# Altium schematic sheet 01.SchDoc
size A1; SPICEModelCacheUOOCPPED: <root> / <DocumentId>UOOCPPED</DocumentId> / <CacheFrame Number="0"> / <Model Name="cap" Kind="MDL"> / <Text>*Default semiconductor capacitor / .MODEL CAP C()</Text> / </Model> / <Model Name="led0" Kind="MDL"> / <Text>*Typ INFRARED GaAs LED: Vf=1.2V Vr=5V If=40mA trr=3uS / *LED Pinout: 1=A, 2=K / .MODEL LED0 D (IS=93.5P RS=84M N=2.63 BV=5 IBV=10U / + CJO=2.97P VJ=.75 M=.333 TT=4.32U)</Text> / </Model> / <Model Name="spdtrelay" Kind="CKT"> / <Text>*Generic SPDT Relay / *Connections:     COM / *                 | NC / *                 | | NO / *                 | | | T1 / *                 | | | | T2 / *                 | | | | | / .SUBCKT SPDTRELAY 1 2 3 4 5 / + PARAMS: PULLIN=4 DROPOFF=0.1 CONTACT=1m RESISTANCE=500 INDUCTANCE=10m / L1 4 6 {(INDUCTANCE/2)} / L2 5 7 {(INDUCTANCE/2)} / R1 6 7 {RESISTANCE} / BNO 8 0 V={PULLIN}-abs(v(6,7)) / SW1 2 1 8 0 SWNC ON / BNC 9 0 V=abs(v(6,7)) / SW2 3 1 9 0 SWNO OFF / .MODEL SWNC SW(VT={DROPOFF} RON={CONTACT} ) / .MODEL SWNO SW(VT={(PULLIN*0.98)} RON={CONTACT} ) / .ENDS SPDTRELAY</Text> / </Model> / </CacheFrame> / </root>
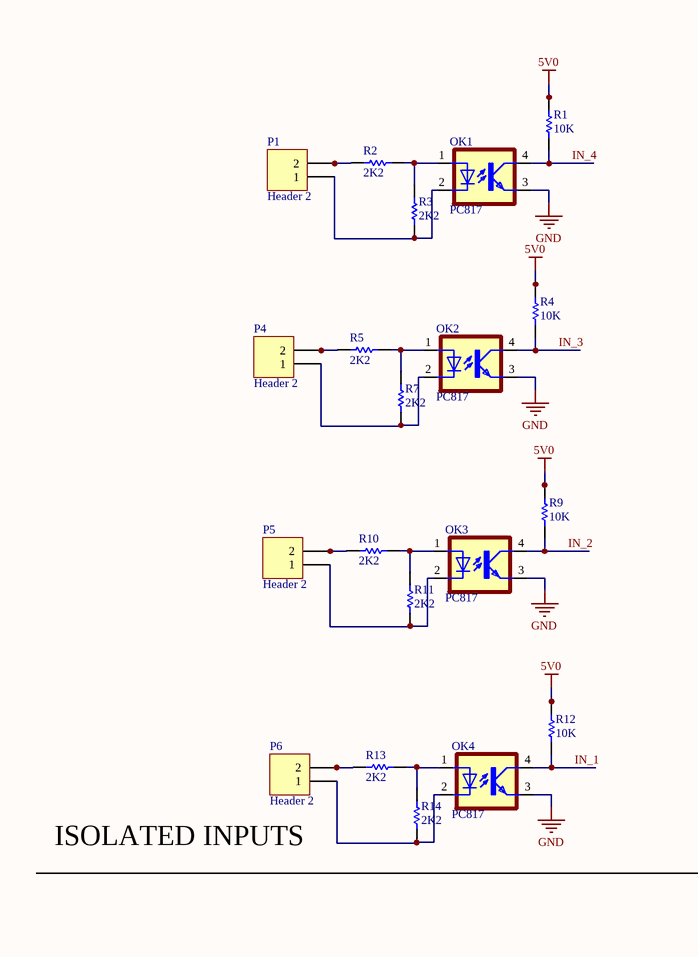
[diagram p0: 01.SchDoc, top left]
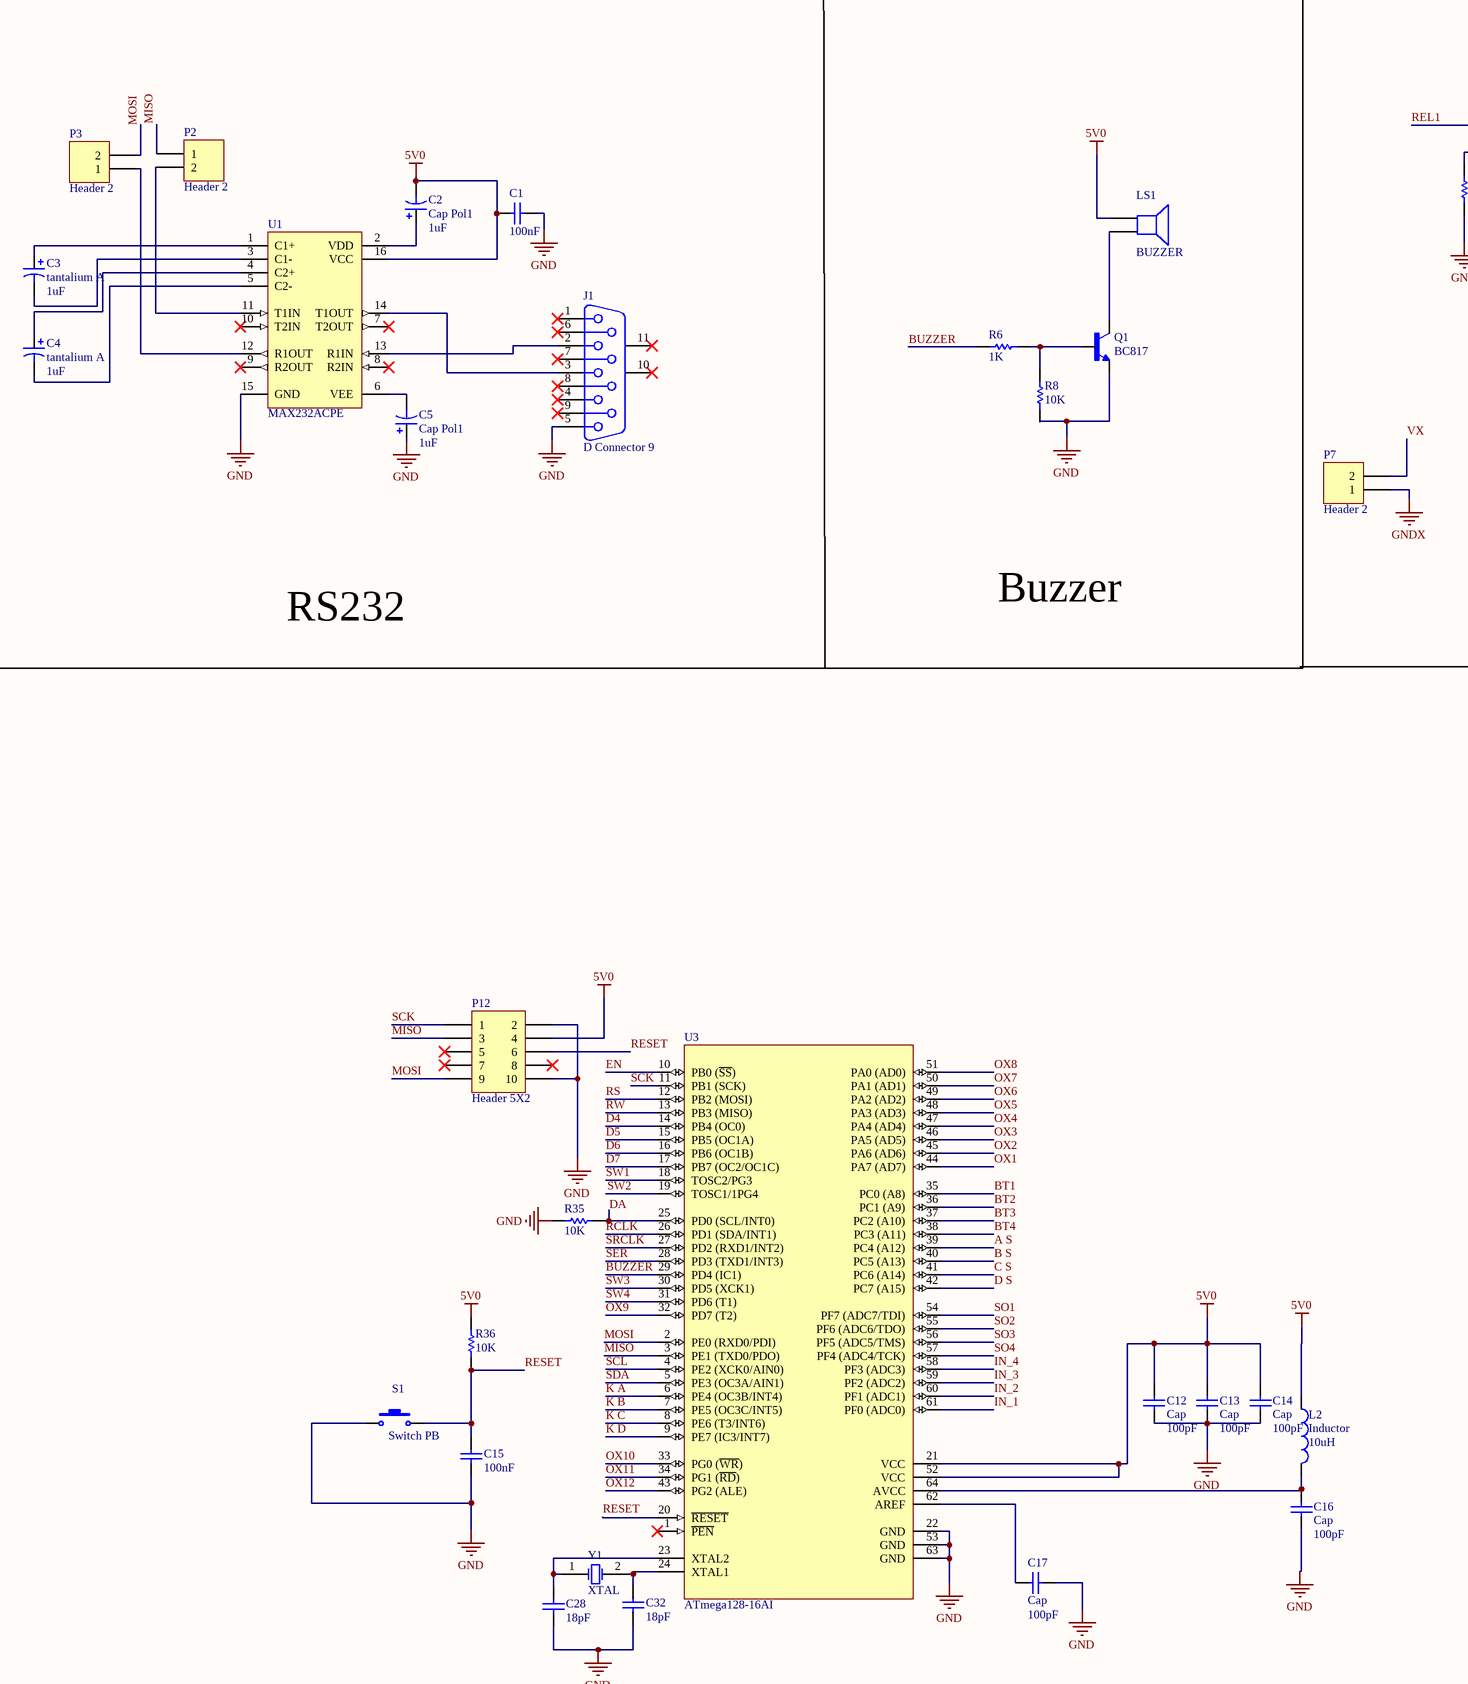
[diagram p1: 01.SchDoc, top middle]
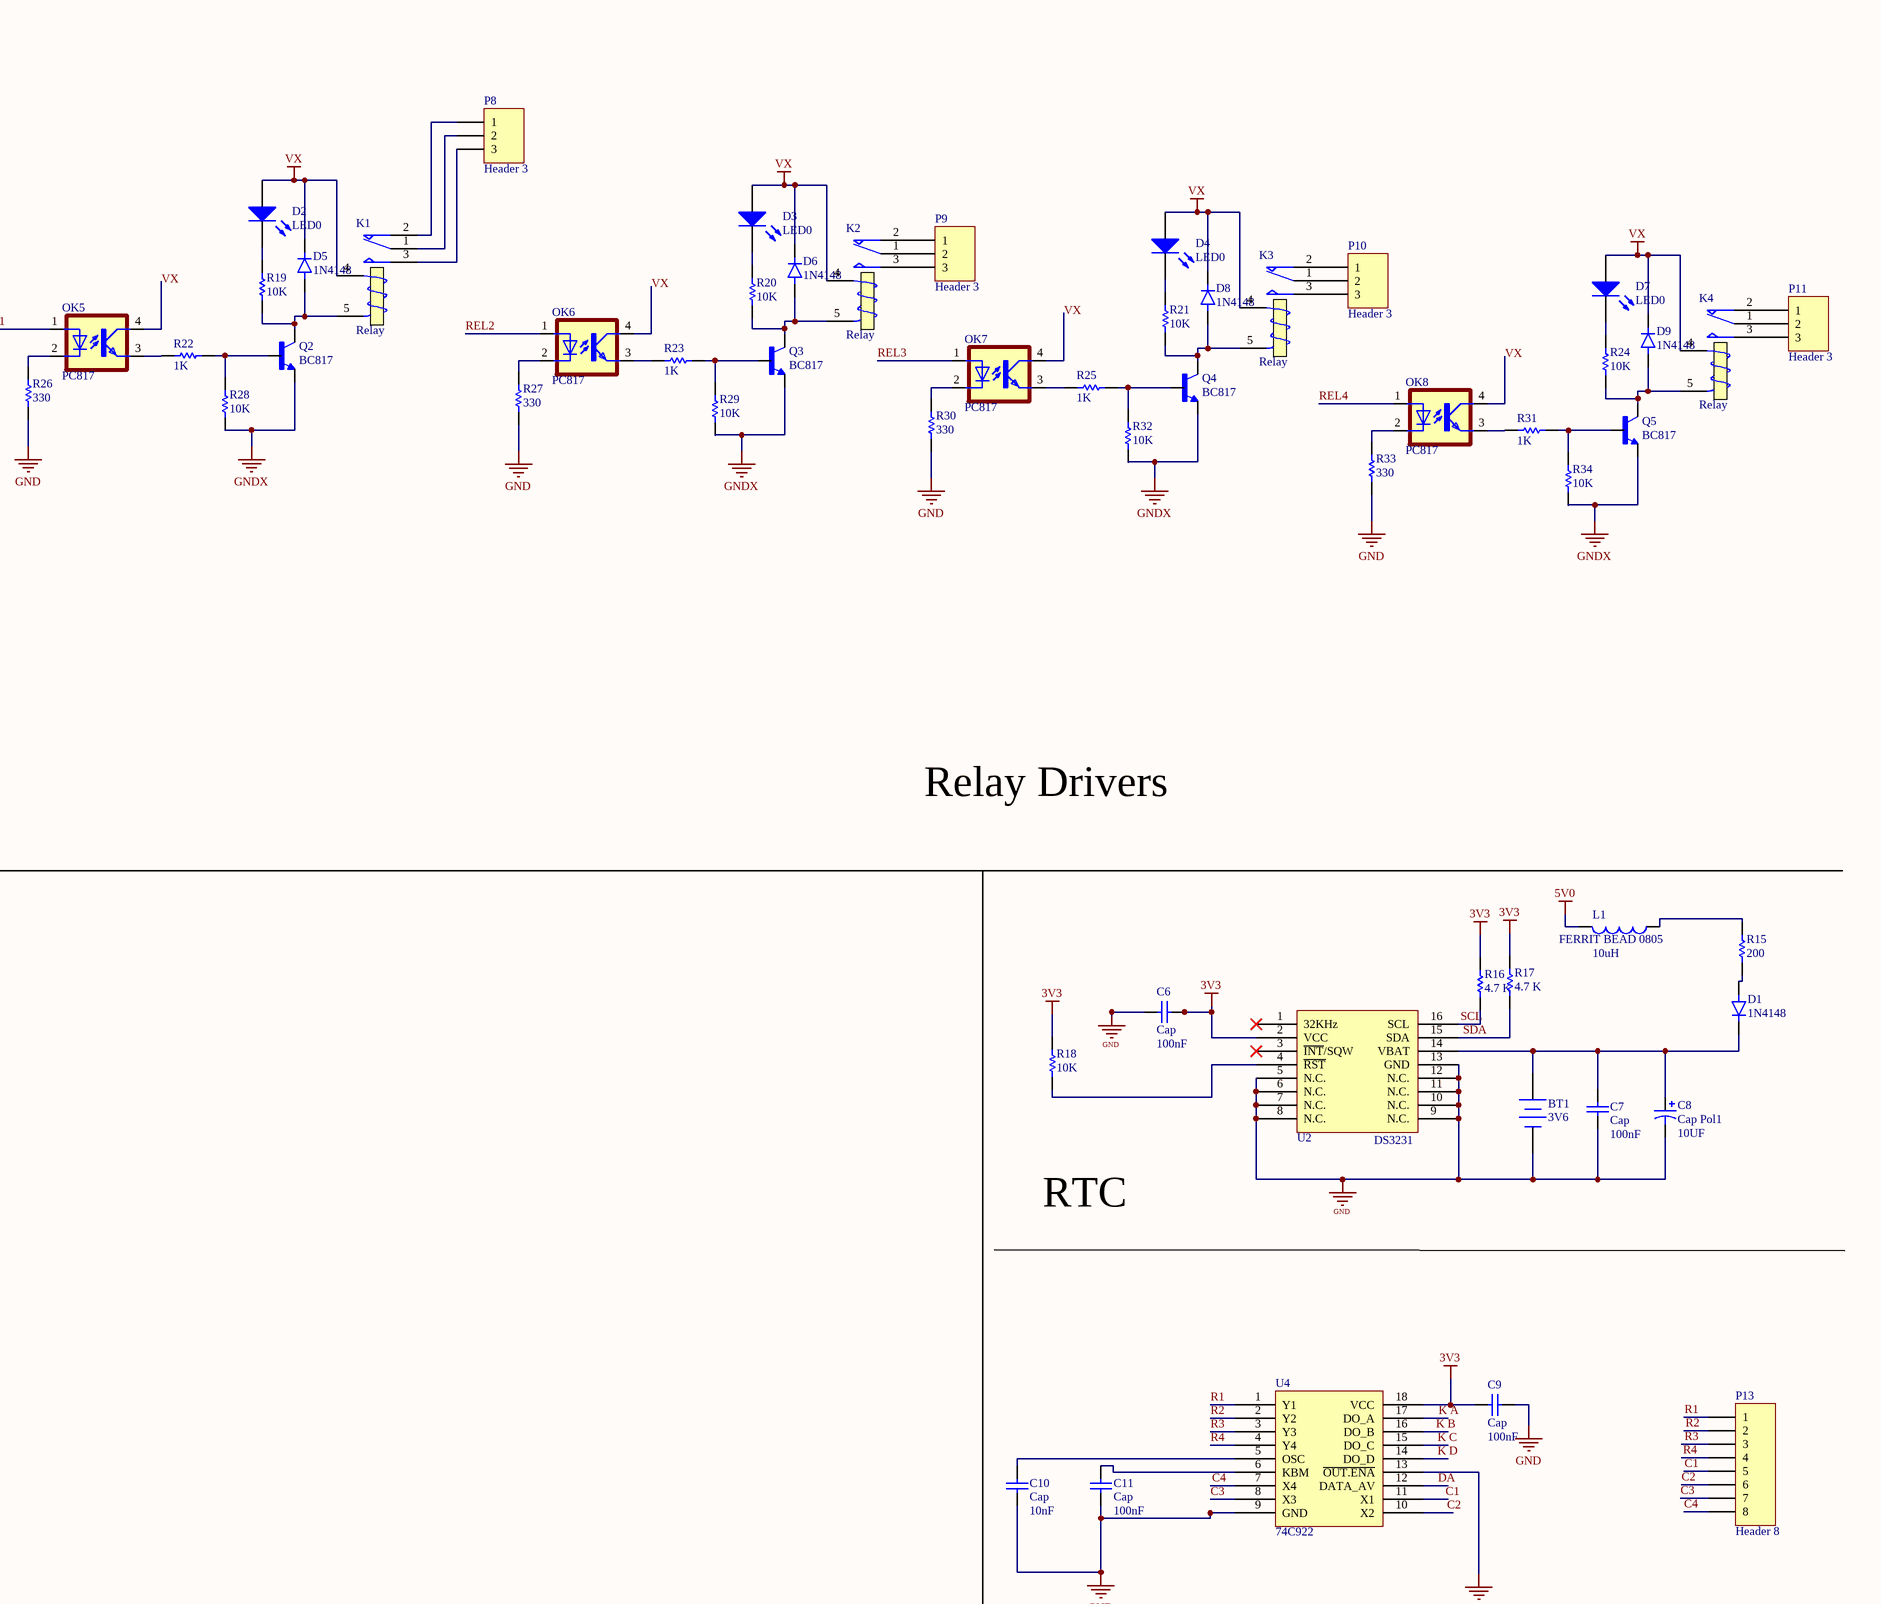
[diagram p2: 01.SchDoc, top right]
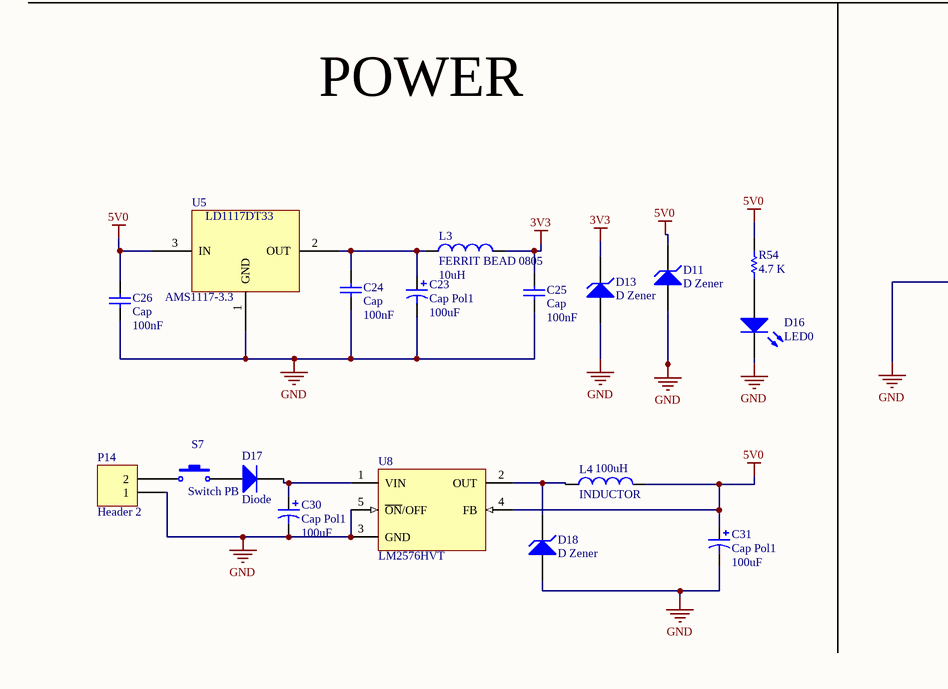
[diagram p3: 01.SchDoc, bottom left]
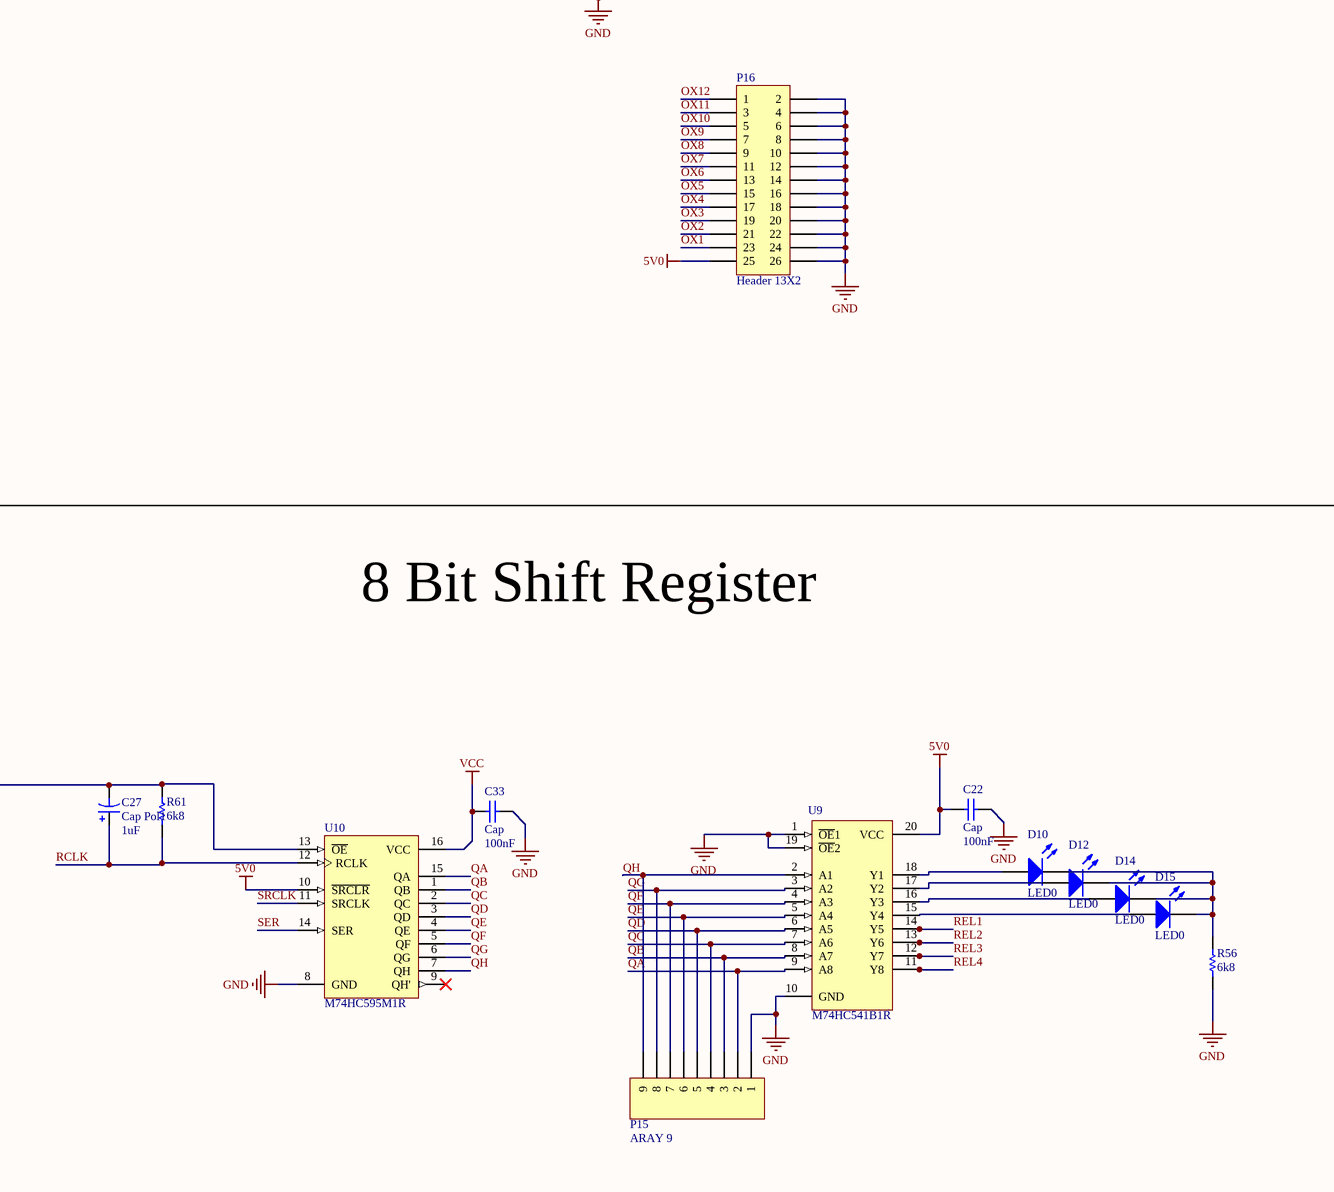
[diagram p4: 01.SchDoc, bottom middle]
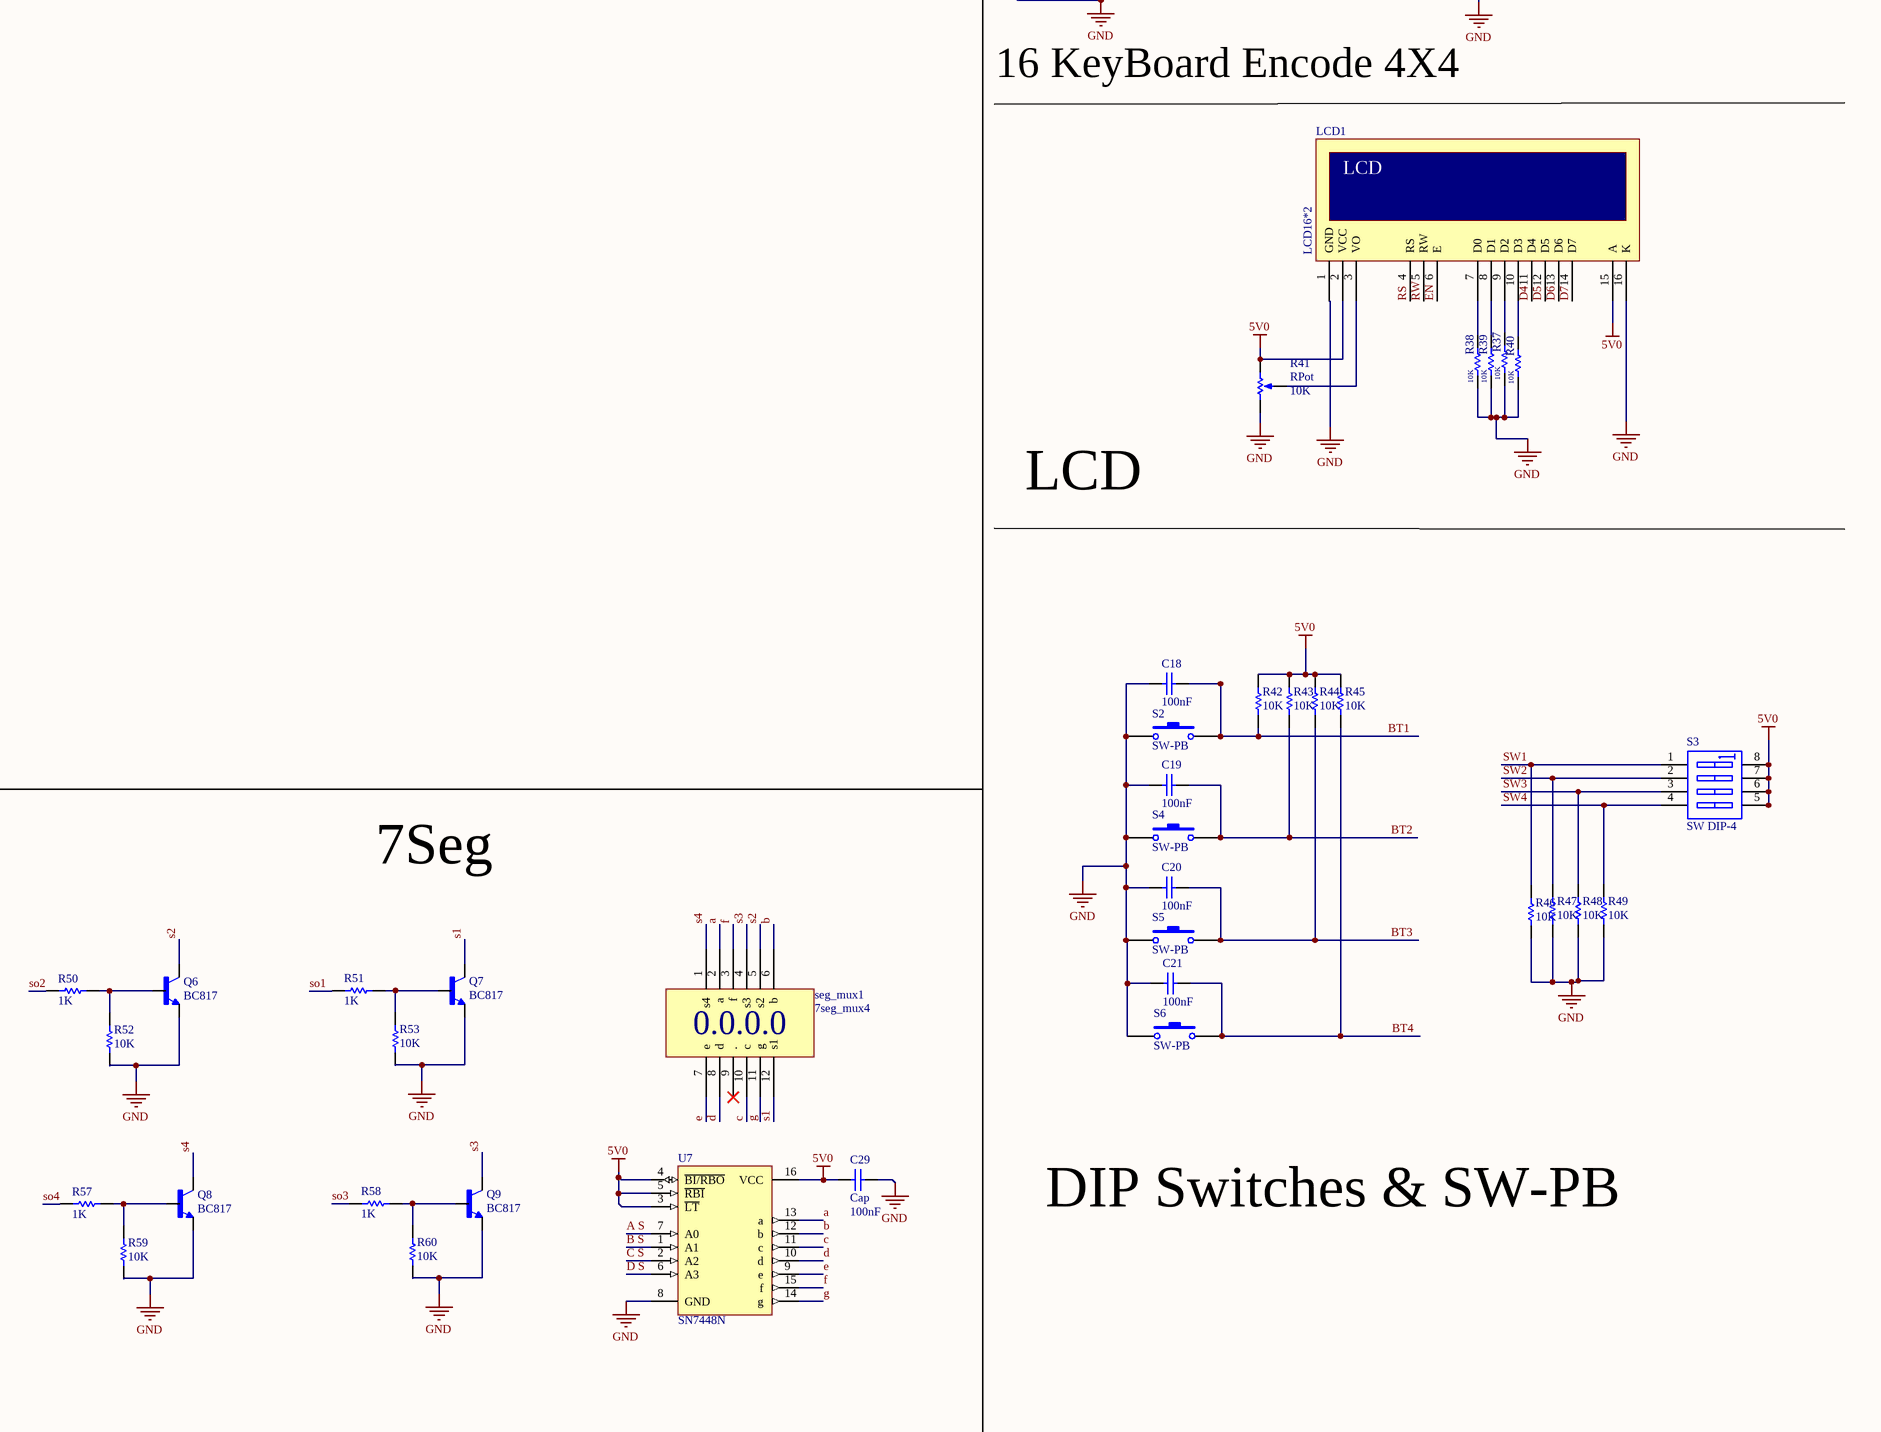
[diagram p5: 01.SchDoc, bottom right]

## Parts
BT1  3V6  [CHARGING_BATT]
C1  100nF  [smd_805]
C2  Cap Pol1  value 1uF  [CAP_SMD_A]
C3  tantalium A  value 1uF  [CAP_SMD_A]
C4  tantalium A  value 1uF  [CAP_SMD_A]
C5  Cap Pol1  value 1uF  [CAP_SMD_A]
C6  Cap  value 100nF  [smd_805]
C7  Cap  value 100nF  [smd_805]
C8  Cap Pol1  value 10UF  [C_B]
C9  Cap  value 100nF  [smd_805]
C10  Cap  value 10nF  [smd_805]
C11  Cap  value 100nF  [smd_805]
C12  Cap  value 100pF  [smd_805]
C13  Cap  value 100pF  [smd_805]
C14  Cap  value 100pF  [smd_805]
C15  100nF  [SMD_805]
C16  Cap  value 100pF  [smd_805]
C17  Cap  value 100pF  [SMD_805]
C18  100nF  [smd_805]
C19  100nF  [smd_805]
C20  100nF  [smd_805]
C21  100nF  [smd_805]
C22  Cap  value 100nF  [smd_805]
C23  Cap Pol1  value 100uF  [C_B]
C24  Cap  value 100nF  [SMD_805]
C25  Cap  value 100nF  [smd_805]
C26  Cap  value 100nF  [smd_805]
C27  Cap Pol1  value 1uF  [CAP_SMD_A]
C28  18pF  [SMD_805]
C29  Cap  value 100nF  [smd_805]
C30  Cap Pol1  value 100uF  [C_CYL_SMD2]
C31  Cap Pol1  value 100uF  [C_CYL_smd]
C32  18pF  [SMD_805]
C33  Cap  value 100nF  [smd_805]
D1  1N4148  [tvs]
D2  LED0  [SMD_805]
D3  LED0  [SMD_805]
D4  LED0  [SMD_805]
D5  1N4148  [tvs]
D6  1N4148  [tvs]
D7  LED0  [SMD_805]
D8  1N4148  [tvs]
D9  1N4148  [tvs]
D10  LED0  [SMD_805]
D11  D Zener  [tvs]
D12  LED0  [SMD_805]
D13  D Zener  [tvs]
D14  LED0  [SMD_805]
D15  LED0  [SMD_805]
D16  LED0  [SMD_805]
D17  Diode  [TVS]
D18  D Zener  [DO_214_AB_SMC]
J1  D Connector 9  [COM]
K1  Relay  [RELAY_12v]
K2  Relay  [RELAY_12v]
K3  Relay  [RELAY_12v]
K4  Relay  [RELAY_12v]
L1  FERRIT BEAD 0805  value 10uH  [SMD_805]
L2  Inductor  value 10uH  [smd_805]
L3  FERRIT BEAD 0805  value 10uH  [0402-A]
L4  INDUCTOR  value 100uH  [INDUC_SMD]
LCD1  LCD16*2  [LCD2X16]
LS1  BUZZER  [BUZZER]
OK1  PC817  [PC817_SMD]
OK2  PC817  [PC817_SMD]
OK3  PC817  [PC817_SMD]
OK4  PC817  [PC817_SMD]
OK5  PC817  [PC817_SMD]
OK6  PC817  [PC817_SMD]
OK7  PC817  [PC817_SMD]
OK8  PC817  [PC817_SMD]
P1  Header 2  [pHoenix_2]
P2  Header 2  [pin_2_w]
P3  Header 2  [pin_2_w]
P4  Header 2  [pHoenix_2]
P5  Header 2  [pHoenix_2]
P6  Header 2  [pHoenix_2]
P7  Header 2  [pHoenix_2]
P8  Header 3  [PHOENIX_3]
P9  Header 3  [PHOENIX_3]
P10  Header 3  [PHOENIX_3]
P11  Header 3  [PHOENIX_3]
P12  Header 5X2  [box2x5_3d]
P13  Header 8  [HEADER_1x8]
P14  Header 2  [ADAP_JACK]
P15  ARAY 9  [Aray 9]
P16  Header 13X2  [HEADER_2x13]
Q1  BC817  [SOT23]
Q2  BC817  [SOT23]
Q3  BC817  [SOT23]
Q4  BC817  [SOT23]
Q5  BC817  [SOT23]
Q6  BC817  [SOT23]
Q7  BC817  [SOT23]
Q8  BC817  [SOT23]
Q9  BC817  [SOT23]
R1  10K  [SMD_805]
R2  2K2  [SMD_805]
R3  2K2  [SMD_805]
R4  10K  [SMD_805]
R5  2K2  [SMD_805]
R6  1K  [SMD_805]
R7  2K2  [SMD_805]
R8  10K  [SMD_805]
R9  10K  [SMD_805]
R10  2K2  [SMD_805]
R11  2K2  [SMD_805]
R12  10K  [SMD_805]
R13  2K2  [SMD_805]
R14  2K2  [SMD_805]
R15  200  [SMD_805]
R16  4.7 K  [SMD_805]
R17  4.7 K  [SMD_805]
R18  10K  [SMD_805]
R19  10K  [SMD_805]
R20  10K  [SMD_805]
R21  10K  [SMD_805]
R22  1K  [SMD_805]
R23  1K  [SMD_805]
R24  10K  [SMD_805]
R25  1K  [SMD_805]
R26  330  [SMD_805]
R27  330  [SMD_805]
R28  10K  [SMD_805]
R29  10K  [SMD_805]
R30  330  [SMD_805]
R31  1K  [SMD_805]
R32  10K  [SMD_805]
R33  330  [SMD_805]
R34  10K  [SMD_805]
R35  10K  [SMD_805]
R36  10K  [SMD_805]
R37  10K  [SMD_805]
R38  10K  [SMD_805]
R39  10K  [SMD_805]
R40  10K  [SMD_805]
R41  RPot  value 10K  [POT]
R42  10K  [SMD_805]
R43  10K  [SMD_805]
R44  10K  [SMD_805]
R45  10K  [SMD_805]
R46  10K  [SMD_805]
R47  10K  [SMD_805]
R48  10K  [SMD_805]
R49  10K  [SMD_805]
R50  1K  [SMD_805]
R51  1K  [SMD_805]
R52  10K  [SMD_805]
R53  10K  [SMD_805]
R54  4.7 K  [SMD_805]
R56  6k8  [SMD_805]
R57  1K  [SMD_805]
R58  1K  [SMD_805]
R59  10K  [SMD_805]
R60  10K  [SMD_805]
R61  6k8  [SMD_805]
S1  Switch PB  [SMD_BUTTON]
S2  SW-PB  [SMD_BUTTON]
S3  SW DIP-4  [DIP_8P]
S4  SW-PB  [SMD_BUTTON]
S5  SW-PB  [SMD_BUTTON]
S6  SW-PB  [SMD_BUTTON]
S7  Switch PB  [KEY1]
seg_mux1  7seg_mux4  [S7_MUX]
U1  MAX232ACPE  [SOP16]
U2  DS3231  [SO16]
U3  ATmega128-16AI  [ATM128]
U4  74C922  [DIP_18P]
U5  AMS1117-3.3  [SOT223]
U7  SN7448N  [DIP_16P]
U8  LM2576HVT  [LM2576_SMD]
U9  M74HC541B1R  [SOP20]
U10  M74HC595M1R  [SO16_L]
Y1  XTAL  [xtal_smd]

## Nets
3V3: C6.2 C9.2 C25.1 D13.2(K) L3.2 R16.2 R17.2 R18.2 U2.2(VCC) U4.18(VCC)
5V0: C1.1 C2.2 C12.1 C13.1 C14.1 C22.2 C26.1 C29.2 C31.1 D11.2(K) L1.2 L2.1 L4.2 LCD1.2(VCC) LCD1.15(A) LS1.1 P12.4 P16.25 R1.1 R4.1 R9.1 R12.1 R36.2 R41.2(BOT) R42.2 R43.2 R44.2 R45.2 R54.2 S3.5(B4) S3.6(B3) S3.7(B2) S3.8(B1) U1.16(VCC) U3.21(VCC) U3.52(VCC) U5.3(IN) U7.3(~{LT}) U7.4(~{BI/RBO}) U7.5(~{RBI}) U7.16(VCC) U8.4(FB) U9.20(VCC) U10.10(~{SRCLR})
GND: BT1.2(-) C1.2 C5.1 C6.1 C7.2 C8.2 C9.1 C10.2 C11.2 C12.2 C13.2 C14.2 C15.1 C16.2 C17.2 C18.1 C19.1 C20.1 C21.1 C22.1 C23.2 C24.2 C25.2 C26.2 C27.2 C28.1 C29.1 C30.2 C31.2 C32.1 C33.1 D11.1(A) D13.1(A) D16.2(K) D18.1(A) J1.5 LCD1.1(GND) LCD1.16(K) OK1.3(EMIT) OK2.3(EMIT) OK3.3(EMIT) OK4.3(EMIT) P12.2 P12.10 P14.1 P15.1 P16.2 P16.4 P16.6 P16.8 P16.10 P16.12 P16.14 P16.16 P16.18 P16.20 P16.22 P16.24 P16.26 Q1.2(E) Q6.2(E) Q7.2(E) Q8.2(E) Q9.2(E) R8.1 R26.1 R27.1 R30.1 R33.1 R35.1 R37.1 R38.1 R39.1 R40.1 R41.1(TOP) R46.1 R47.1 R48.1 R49.1 R52.1 R53.1 R56.1 R59.1 R60.1 R61.2 S1.1 S2.1 S4.1 S5.1 S6.1 U1.15(GND) U2.5(N.C.) U2.6(N.C.) U2.7(N.C.) U2.8(N.C.) U2.9(N.C.) U2.10(N.C.) U2.11(N.C.) U2.12(N.C.) U2.13(GND) U3.22(GND) U3.53(GND) U3.63(GND) U4.9(GND) U4.13(~{OUT.ENA}) U5.1(GND) U7.8(GND) U8.3(GND) U8.5(~{ON}/OFF) U9.1(~{OE}1) U9.10(GND) U9.19(~{OE}2) U10.8(GND) U10.13(~{OE})
GNDX: P7.1 Q2.2(E) Q3.2(E) Q4.2(E) Q5.2(E) R28.1 R29.1 R32.1 R34.1
VCC: C33.2 U10.16(VCC)
VX: D2.1(A) D3.1(A) D4.1(A) D5.C D6.C D7.1(A) D8.C D9.C K1.4(T1) K2.4(T1) K3.4(T1) K4.4(T1) OK5.4(COL) OK6.4(COL) OK7.4(COL) OK8.4(COL) P7.2
a: seg_mux1.2(a) U7.13(a)
A S: U3.39(PC4_(A12)) U7.7(A0)
b: seg_mux1.6(b) U7.12(b)
B S: U3.40(PC5_(A13)) U7.1(A1)
BT1: C18.2 R42.1 S2.2 U3.35(PC0_(A8))
BT2: C19.2 R43.1 S4.2 U3.36(PC1_(A9))
BT3: C20.2 R44.1 S5.2 U3.37(PC2_(A10))
BT4: C21.2 R45.1 S6.2 U3.38(PC3_(A11))
BUZZER: R6.1 U3.29(PD4_(IC1))
c: seg_mux1.10(c) U7.11(c)
C1: P13.5 U4.11(X1)
C2: P13.6 U4.10(X2)
C3: P13.7 U4.8(X3)
C4: P13.8 U4.7(X4)
C S: U3.41(PC6_(A14)) U7.2(A2)
d: seg_mux1.8(d) U7.10(d)
D4: LCD1.11(D4) U3.14(PB4_(OC0))
D5: LCD1.12(D5) U3.15(PB5_(OC1A))
D6: LCD1.13(D6) U3.16(PB6_(OC1B))
D7: LCD1.14(D7) U3.17(PB7_(OC2/OC1C))
D S: U3.42(PC7_(A15)) U7.6(A3)
DA: R35.2 U3.25(PD0_(SCL/INT0)) U4.12(DATA_AV)
e: seg_mux1.7(e) U7.9(e)
EN: LCD1.6(E) U3.10(PB0_(~{SS}))
f: seg_mux1.3(f) U7.15(f)
g: seg_mux1.11(g) U7.14(g)
IN_1: OK4.4(COL) R12.2 U3.61(PF0_(ADC0))
IN_2: OK3.4(COL) R9.2 U3.60(PF1_(ADC1))
IN_3: OK2.4(COL) R4.2 U3.59(PF2_(ADC2))
IN_4: OK1.4(COL) R1.2 U3.58(PF3_(ADC3))
K A: U3.6(PE4_(OC3B/INT4)) U4.17(DO_A)
K B: U3.7(PE5_(OC3C/INT5)) U4.16(DO_B)
K C: U3.8(PE6_(T3/INT6)) U4.15(DO_C)
K D: U3.9(PE7_(IC3/INT7)) U4.14(DO_D)
MISO: P2.1 P12.3 U3.3(PE1_(TXD0/PDO))
MOSI: P3.2 P12.9 U3.2(PE0_(RXD0/PDI))
OX1: P16.23 U3.44(PA7_(AD7))
OX2: P16.21 U3.45(PA6_(AD6))
OX3: P16.19 U3.46(PA5_(AD5))
OX4: P16.17 U3.47(PA4_(AD4))
OX5: P16.15 U3.48(PA3_(AD3))
OX6: P16.13 U3.49(PA2_(AD2))
OX7: P16.11 U3.50(PA1_(AD1))
OX8: P16.9 U3.51(PA0_(AD0))
OX9: P16.7 U3.32(PD7_(T2))
OX10: P16.5 U3.33(PG0_(~{WR}))
OX11: P16.3 U3.34(PG1_(~{RD}))
OX12: P16.1 U3.43(PG2_(ALE))
QA: P15.2 U9.9(A8) U10.15(QA)
QB: P15.3 U9.8(A7) U10.1(QB)
QC: P15.4 U9.7(A6) U10.2(QC)
QD: P15.5 U9.6(A5) U10.3(QD)
QE: P15.6 U9.5(A4) U10.4(QE)
QF: P15.7 U9.4(A3) U10.5(QF)
QG: P15.8 U9.3(A2) U10.6(QG)
QH: P15.9 U9.2(A1) U10.7(QH)
R1: P13.1 U4.1(Y1)
R2: P13.2 U4.2(Y2)
R3: P13.3 U4.3(Y3)
R4: P13.4 U4.4(Y4)
RCLK: C27.1 R61.1 U3.26(PD1_(SDA/INT1)) U10.12(RCLK)
REL1: OK5.1(A) U9.14(Y5)
REL2: OK6.1(A) U9.13(Y6)
REL3: OK7.1(A) U9.12(Y7)
REL4: OK8.1(A) U9.11(Y8)
RESET: C15.2 P12.6 R36.1 S1.2 U3.20(~{RESET})
RS: LCD1.4(RS) U3.12(PB2_(MOSI))
RW: LCD1.5(RW) U3.13(PB3_(MISO))
s1: Q7.3(C) seg_mux1.12(s1)
s2: Q6.3(C) seg_mux1.5(s2)
s3: Q9.3(C) seg_mux1.4(s3)
s4: Q8.3(C) seg_mux1.1(s4)
SCK: P12.1 U3.11(PB1_(SCK))
SCL: R16.1 U2.16(SCL) U3.4(PE2_(XCK0/AIN0))
SDA: R17.1 U2.15(SDA) U3.5(PE3_(OC3A/AIN1))
SER: U3.28(PD3_(TXD1/INT3)) U10.14(SER)
so1: R51.1 U3.54(PF7_(ADC7/TDI))
so2: R50.1 U3.55(PF6_(ADC6/TDO))
so3: R58.1 U3.56(PF5_(ADC5/TMS))
so4: R57.1 U3.57(PF4_(ADC4/TCK))
SRCLK: U3.27(PD2_(RXD1/INT2)) U10.11(SRCLK)
SW1: R46.2 S3.1(A1) U3.18(TOSC2/PG3)
SW2: R47.2 S3.2(A2) U3.19(TOSC1/1PG4)
SW3: R48.2 S3.3(A3) U3.30(PD5_(XCK1))
SW4: R49.2 S3.4(A4) U3.31(PD6_(T1))
NetBT1_1: BT1.1(+) C7.1 C8.1 D1.C U2.14(VBAT)
NetC2_1: C2.1 U1.2(VDD)
NetC3_1: C3.1 U1.1(C1+)
NetC3_2: C3.2 U1.3(C1-)
NetC4_1: C4.1 U1.4(C2+)
NetC4_2: C4.2 U1.5(C2-)
NetC5_2: C5.2 U1.6(VEE)
NetC10_1: C10.1 U4.5(OSC)
NetC11_1: C11.1 U4.6(KBM)
NetC16_1: C16.1 L2.2 U3.64(AVCC)
NetC17_1: C17.1 U3.62(AREF)
NetC23_1: C23.1 C24.1 L3.1 U5.2(OUT)
NetC28_2: C28.2 U3.23(XTAL2) Y1.1(OSC1)
NetC30_1: C30.1 D17.2(K) U8.1(VIN)
NetC32_2: C32.2 U3.24(XTAL1) Y1.2(OSC2)
NetD1_A: D1.A R15.1
NetD2_2: D2.2(K) R19.2
NetD3_2: D3.2(K) R20.2
NetD4_2: D4.2(K) R21.2
NetD5_A: D5.A K1.5(T2) Q2.3(C) R19.1
NetD6_A: D6.A K2.5(T2) Q3.3(C) R20.1
NetD7_2: D7.2(K) R24.2
NetD8_A: D8.A K3.5(T2) Q4.3(C) R21.1
NetD9_A: D9.A K4.5(T2) Q5.3(C) R24.1
NetD10_1: D10.1(A) U9.18(Y1)
NetD10_2: D10.2(K) D12.2(K) D14.2(K) D15.2(K) R56.2
NetD12_1: D12.1(A) U9.17(Y2)
NetD14_1: D14.1(A) U9.16(Y3)
NetD15_1: D15.1(A) U9.15(Y4)
NetD16_1: D16.1(A) R54.1
NetD18_2: D18.2(K) L4.1 U8.2(OUT)
NetJ1_2: J1.2 U1.13(R1IN)
NetJ1_3: J1.3 U1.14(T1OUT)
NetK1_1: K1.1(COM) P8.2
NetK1_2: K1.2(NC) P8.1
NetK1_3: K1.3(NO) P8.3
NetK2_1: K2.1(COM) P9.2
NetK2_2: K2.2(NC) P9.1
NetK2_3: K2.3(NO) P9.3
NetK3_1: K3.1(COM) P10.2
NetK3_2: K3.2(NC) P10.1
NetK3_3: K3.3(NO) P10.3
NetK4_1: K4.1(COM) P11.2
NetK4_2: K4.2(NC) P11.1
NetK4_3: K4.3(NO) P11.3
NetL1_1: L1.1 R15.2
NetLCD1_3: LCD1.3(VO) R41.3(TAP)
NetLCD1_7: LCD1.7(D0) R38.2
NetLCD1_8: LCD1.8(D1) R39.2
NetLCD1_9: LCD1.9(D2) R37.2
NetLCD1_10: LCD1.10(D3) R40.2
NetLS1_2: LS1.2 Q1.3(C)
NetOK1_1: OK1.1(A) R2.2 R3.2
NetOK1_2: OK1.2(C) P1.1 R3.1
NetOK2_1: OK2.1(A) R5.2 R7.2
NetOK2_2: OK2.2(C) P4.1 R7.1
NetOK3_1: OK3.1(A) R10.2 R11.2
NetOK3_2: OK3.2(C) P5.1 R11.1
NetOK4_1: OK4.1(A) R13.2 R14.2
NetOK4_2: OK4.2(C) P6.1 R14.1
NetOK5_2: OK5.2(C) R26.2
NetOK5_3: OK5.3(EMIT) R22.1
NetOK6_2: OK6.2(C) R27.2
NetOK6_3: OK6.3(EMIT) R23.1
NetOK7_2: OK7.2(C) R30.2
NetOK7_3: OK7.3(EMIT) R25.1
NetOK8_2: OK8.2(C) R33.2
NetOK8_3: OK8.3(EMIT) R31.1
NetP1_2: P1.2 R2.1
NetP2_2: P2.2 U1.11(T1IN)
NetP3_1: P3.1 U1.12(R1OUT)
NetP4_2: P4.2 R5.1
NetP5_2: P5.2 R10.1
NetP6_2: P6.2 R13.1
NetP14_2: P14.2 S7.1
NetQ1_1: Q1.1(B) R6.2 R8.2
NetQ2_1: Q2.1(B) R22.2 R28.2
NetQ3_1: Q3.1(B) R23.2 R29.2
NetQ4_1: Q4.1(B) R25.2 R32.2
NetQ5_1: Q5.1(B) R31.2 R34.2
NetQ6_1: Q6.1(B) R50.2 R52.2
NetQ7_1: Q7.1(B) R51.2 R53.2
NetQ8_1: Q8.1(B) R57.2 R59.2
NetQ9_1: Q9.1(B) R58.2 R60.2
NetR18_1: R18.1 U2.4(~{RST})

Not connected (* = marked no-connect by the designer): D17 1(A); J1 1* 4* 6* 7* 8* 9* 10(MH1)* 11(MH2)*; P12 5* 7* 8*; S7 2; seg_mux1 9(.)*; U1 7(T2OUT)* 8(R2IN)* 9(R2OUT)* 10(T2IN)*; U2 1(32KHz)* 3(~{INT}/SQW)*; U3 1(~{PEN})*; U10 9(QH')*

## Notes on the sheet
- ISOLATED INPUTS
- RS232
- Buzzer
- Relay Drivers
- RTC
- 16 KeyBoard Encode 4X4
- LCD
- POWER
- 8 Bit Shift Register
- 7Seg
- DIP Switches & SW-PB
- (in symbol 7seg_mux4) 0.0.0.0
- (in symbol LCD16*2) LCD

## Library data of the parts
BT1 = Battery: Multicell Battery; Published: 24-Mar-1999; LatestRevisionDate: 17-Jul-2002; LatestRevisionNote: Re-released for DXP Platform.; PackageReference: BAT-2; Publisher: Altium Limited; PackageDescription: Battery; 2 Leads
C1 C15 C18-C21 C28 C32 = CAP SMD 1206: CAP 1206; Designer: Abbas Basereh; Desc.: CAP SMD 1206; Data: 16-12-2016
C2-C5 C8 C23 C27 C30 C31 = Cap Pol1: Polarized Capacitor (Radial); Published: 8-Jun-2000; LatestRevisionDate: 17-Jul-2002; LatestRevisionNote: Re-released for DXP Platform.; PackageReference: RB7.6-15; Publisher: Altium Limited; PackageDescription: Polarized Capacitor (Radial); 2 Leads
C6 C7 C9-C14 C16 C17 C22 C24-C26 C29 C33 = Cap: Capacitor; Published: 8-Jun-2000; LatestRevisionDate: 17-Jul-2002; LatestRevisionNote: Re-released for DXP Platform.; PackageReference: RAD-0.3; Publisher: Altium Limited; PackageDescription: Radial Cap, Thru-Hole; 2 Leads; 0.3 in Pin Spacing
D1 D5 D6 D8 D9 = 1N4148: Small Signal Fast Switching Diodes; Price: None; MP: 1N4148; Value: *; Availability: Unavailable; Package: None
D2-D4 D7 D10 D12 D14-D16 = LED0: Typical INFRARED GaAs LED; Published: 8-Jun-2000; LatestRevisionDate: 08-Jul-2005; LatestRevisionNote: Mech Layer 1 removed.; PackageReference: LED-0; Publisher: Altium Limited; PackageDescription: LED; 2 Leads
D11 D13 D18 = D Zener: Zener Diode; Published: 8-Jun-2000; LatestRevisionDate: 17-Jul-2002; LatestRevisionNote: Re-released for DXP Platform.; PackageReference: DIODE-0.7; Publisher: Altium Limited; PackageDescription: Diode, Thru-Hole; 2 Leads; 0.7 in Pin Spacing
D17 = Diode: Default Diode; Published: 8-Jun-2000; LatestRevisionDate: 17-Jul-2002; LatestRevisionNote: Re-released for DXP Platform.; PackageVersion: Sep-1996; PackageReference: SMC; Publisher: Altium Limited; PackageDescription: DO-214-AB/SMC; 2 C-Bend Leads; Body 7.9 x 5.9 mm, inc. leads (LxW); Code_JEDEC: DO-214-AB
J1 = D Connector 9: Receptacle Assembly, 9 Position, Right Angle; PackageDocument: O; Positions: 9; Published: 15-Jun-2001; LatestRevisionDate: 17-Jul-2002; LatestRevisionNote: Re-released for DXP Platform.; DatasheetDocument: 1-Sep-1999; PackageReference: 788750; Publisher: Altium Limited; Orientation: Right Angle; Gender: Receptacle
K1-K4 = Relay: SPDT Relay; Published: 8-Jun-2000; LatestRevisionDate: 17-Jul-2002; LatestRevisionNote: Re-released for DXP Platform.; PackageReference: MODULE5B; Publisher: Altium Limited
L1-L4 = Inductor: Code_IEC: 1005; Published: 8-Jun-2000; LatestRevisionDate: 29-May-2009; LatestRevisionNote: IPC-7351 Footprint Added.; PackageReference: 0402-A; Publisher: Altium Limited; PackageDescription: Chip Inductor; Code_JEITA: 0402
LS1 = Speaker: Loudspeaker; Published: 24-Mar-1999; LatestRevisionDate: 17-Jul-2002; LatestRevisionNote: Re-released for DXP Platform.; PackageReference: PIN2; Publisher: Altium Limited
OK1-OK8 = PC817: RF Mixer IC Cellular, DCS, PCS, W-CDMA, WLAN Up Converter 50MHz ~ 400MHz 6-SuperMiniMold; MF: Renesas Electronics America Inc; Price: None; Availability: In Stock; SnapEDA_Link: https://www.snapeda.com/parts/PC817/Renesas/view-part/6617977/?ref=snap; Value: *; Check_prices: https://www.snapeda.com/parts/PC817/Renesas/view-part/6617977/?ref=eda; Purchase-URL: https://pricing.snapeda.com/search/part/PC817/?ref=eda; MP: PC817; Package: None
P1-P7 P14 = Header 2: Header, 2-Pin; LatestRevisionDate: 17-Jul-2002; LatestRevisionNote: Re-released for DXP Platform.; Publisher: Altium Limited
P8-P11 = Header 3: Header, 3-Pin; LatestRevisionDate: 17-Jul-2002; LatestRevisionNote: Re-released for DXP Platform.; Publisher: Altium Limited
P12 = Header 5X2: Header, 5-Pin, Dual row; LatestRevisionDate: 17-Jul-2002; LatestRevisionNote: Re-released for DXP Platform.; Publisher: Altium Limited
P13 = Header 8: Header, 8-Pin; LatestRevisionDate: 17-Jul-2002; LatestRevisionNote: Re-released for DXP Platform.; Publisher: Altium Limited
P15 = Header 9: Header, 9-Pin; LatestRevisionDate: 17-Jul-2002; LatestRevisionNote: Re-released for DXP Platform.; Publisher: Altium Limited
P16 = Header 13X2: Header, 13-Pin, Dual row; LatestRevisionDate: 17-Jul-2002; LatestRevisionNote: Re-released for DXP Platform.; Publisher: Altium Limited
Q1-Q9 = BC817: Bipolar _BJT_ Transistor NPN 45V 500mA 100MHz 300mW Surface Mount SOT-23-3 _TO-236_; MF: Nexperia USA; Availability: Unavailable; Package: SOT-23-3 Rectron; Price: None; SnapEDA_Link: https://www.snapeda.com/parts/BC817/Nexperia%20USA%20Inc./view-part/4219270/?ref=snap; Value: *; MP: BC817
R1-R40 R42-R54 R56-R61 = RES 0805 0.125W: RES 0805; Designer: Abbas Basereh; Desc.: RES SMD 0805; Data: 16-12-2016
R41 = RPot: Potentiometer; Sim Note: Enter the Resistance value and the set point into parameter fields.; Set Position: 0.5; Published: 8-Jun-2000; LatestRevisionDate: 17-Jul-2002; LatestRevisionNote: Re-released for DXP Platform.; PackageReference: VR5; Publisher: Altium Limited; PackageDescription: Variable Resistor, Thru-Hole; 3 Leads
S1 S7 = Switch PB: Push Button Switch
S2 S4-S6 = SW-PB: Switch; Published: 24-Mar-1999; LatestRevisionDate: 17-Jul-2002; LatestRevisionNote: Re-released for DXP Platform.; PackageReference: SPST-2; Publisher: Altium Limited; PackageDescription: Switch; 2 Leads
S3 = SW DIP-4: DIP Switch, 4 Position, SPST; Published: 24-Mar-1999; LatestRevisionDate: 29-May-2009; LatestRevisionNote: IPC-7351 Footprint Added.; PackageVersion: Dec-2002; PackageReference: SO8; Publisher: Altium Limited; PackageDescription: 8-Pin Small Outline Integrated Circuit 1.27 mm Pitch; Code_JEDEC: MS-012-AA; Code_IPC: SOIC127P600-8
U1 = MAX232ACPE: +5V Powered, Multi-Channel RS-232 Driver/Receiver; Published: 16-Jan-2001; LatestRevisionDate: 29-May-2009; LatestRevisionNote: Component Body Added.; PackageVersion: 1997; PackageReference: PE16A; Publisher: Altium Limited; PackageDescription: DIP, 16-Pin, Row Spacing 7.62 mm, Pitch 2.54 mm; Code_JEDEC: MS-001-BB; ComponentLink1Description: Manufacturer Link; ComponentLink1URL: http://www.maxim-ic.com/; ComponentLink2Description: Datasheet; ComponentLink2URL: http://pdfserv.maxim-ic.com/en/ds/MAX220-MAX249.pdf
U3 = ATmega128-16AI: 8-Bit AVR Microcontroller with 128K Bytes of In-System Programmable Flash Memory; Published: 17-Sep-2003; LatestRevisionDate: 13-Apr-2006; LatestRevisionNote: IPC-7351 Footprint Added.; DatasheetVersion: 2467G-AVR-09/02; PackageVersion: revB, Oct-2001; PackageReference: 64A; Publisher: Altium Limited; PackageDescription: 64-Pin Thin Quad Flat Pack 0.8 mm Pitch; Code_JEDEC: MS-026-AEB; ComponentLink1Description: Manufacturer Link; ComponentLink1URL: http://www.atmel.com; ComponentLink2Description: Datasheet; ComponentLink2URL: http://www.atmel.com/dyn/resources/prod_documents/doc2467.pdf
U4 = Component_1
U5 = LD1117DT33
U7 = SN7448N: BCD-to-Seven-Segment Decoder/Driver; ComponentAvailability: Obsolete; Published: 8-Jun-2000; LatestRevisionDate: 29-May-2009; LatestRevisionNote: Component Body Added.; DatasheetVersion: Mar-1988; PackageVersion: Oct-1995; PackageReference: N016; Publisher: Altium Limited; PackageDescription: DIP, 16-Pin, Row Spacing 7.62 mm, Pitch 2.54 mm; Code_JEDEC: MS-001-BB; ComponentLink1Description: Manufacturer Link; ComponentLink1URL: http://www.ti.com/; ComponentLink2Description: Datasheet; ComponentLink2URL: http://www-s.ti.com/sc/ds/sn7448.pdf; ComponentLink3Description: URL Link1; ComponentLink3URL: http://focus.ti.com/docs/prod/folders/print/sn7448.html
U8 = LM2576HVT-3.3: SIMPLE SWITCHER® 3A Step-Down Voltage Regulator, 5-pin TO-220; Manufacturer: National Semiconductor; PackageTopMarking: NSUZXYTT*LM2576HVT*-3.3 P+; Published: 4-Dec-2008; DatasheetVersion: Aug-2004; PackageVersion: revJ, Jan-1992; PackageReference: T05A; Publisher: Altium Limited; PackageDescription: TO-220, Molded, 5 Lead, Straight; PartNumber: LM2576HVT-3.3; RoHS: Y; PinCount: 5; CompType: Switcher; Code_JEDEC: TO-220-AB; ComponentLink1Description: LM2576HV Datasheet; ComponentLink1URL: http://www.national.com/ds/LM/LM2576HV.pdf; ComponentLink2Description: LM2576HV Web Page
U9 = M74HC541B1R: Octal Bus Buffer with 3 State Outputs (Non Inverted); Published: 8-Jun-2000; LatestRevisionDate: 06-Jun-2005; LatestRevisionNote: Stylized 3D Model Added.; DatasheetVersion: Oct-1993; PackageVersion: Jun-1998; PackageReference: DIP20; Publisher: Altium Limited; PackageDescription: DIP; 20 Leads; Row Spacing 7.62 mm; Pitch 2.54 mm; Code_JEDEC: MS-015-AE; ComponentLink1Description: Manufacturer Link; ComponentLink1URL: http://www.st.com/
U10 = M74HC595M1R: 8 Bit Shift Register with Output Latches (3 STATE); Published: 8-Jun-2000; LatestRevisionDate: 13-Apr-2006; LatestRevisionNote: IPC-7351 Footprint Added.; DatasheetVersion: Apr-1993; PackageVersion: May-1998; PackageReference: SO16; Publisher: Altium Limited; PackageDescription: 16-Pin Small Outline Integrated Circuit 1.27 mm Pitch; Code_IPC: SOIC127P600-16; ComponentLink1Description: Manufacturer Link; ComponentLink1URL: http://www.st.com/; ComponentLink2Description: Datasheet; ComponentLink2URL: http://www.st.com/stonline/products/literature/ds/1989/m74hc595.pdf
Y1 = XTAL: Crystal Oscillator; Published: 8-Jun-2000; LatestRevisionDate: 17-Jul-2002; LatestRevisionNote: Re-released for DXP Platform.; PackageReference: R38; Publisher: Altium Limited; PackageDescription: Crystal, Thru-Hole; 2 Leads; Body 3.1 x 8.2 mm (Dia.xH)